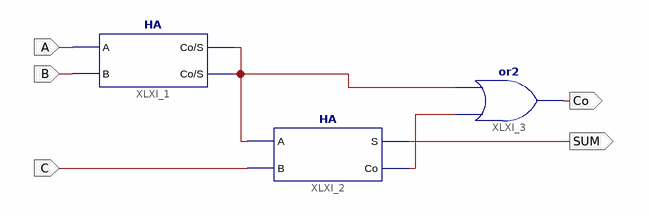
[diagram p0: schematic sheet 1]
// Xilinx ISE schematic FA.sch (artix7) as structural Verilog: 3 symbols, 5 ports
module FA (
  input  A,
  input  B,
  input  C,
  output SUM,
  output Co
);

  wire XLXN_3, XLXN_4;

  HA XLXI_1 (.A(A), .B(B), .Co(XLXN_3), .S(XLXN_3));
  HA XLXI_2 (.A(XLXN_3), .B(C), .Co(XLXN_4), .S(SUM));
  or XLXI_3 (Co, XLXN_4, XLXN_3);
endmodule
